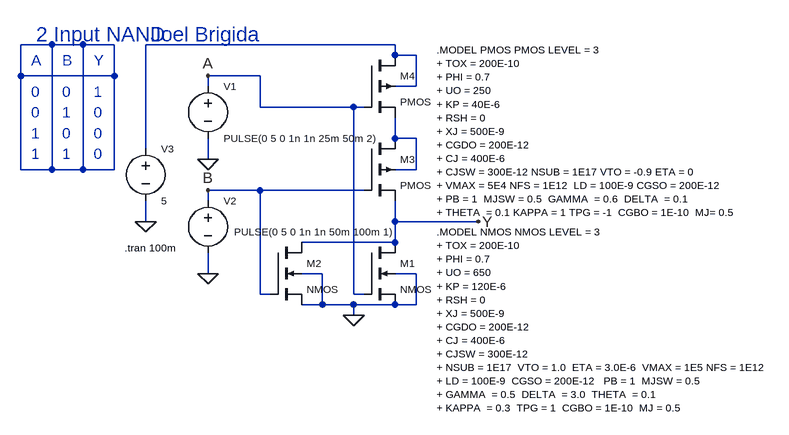
[diagram p0: schematic 2NOR.asc]
2NOR.asc, the LTspice schematic file:
Version 4
SHEET 1 880 680
WIRE -224 -128 -272 -128
WIRE -176 -128 -224 -128
WIRE -128 -128 -176 -128
WIRE 304 -128 -80 -128
WIRE 304 -112 304 -128
WIRE 336 -112 304 -112
WIRE -272 -80 -272 -128
WIRE -128 -80 -128 -128
WIRE -128 -80 -272 -80
WIRE 96 -80 16 -80
WIRE 16 -64 16 -80
WIRE 336 -64 336 -112
WIRE 336 -64 304 -64
WIRE 96 -32 96 -80
WIRE 240 -32 96 -32
WIRE 256 -32 240 -32
WIRE 304 16 304 -16
WIRE 336 16 304 16
WIRE -80 32 -80 -128
WIRE 16 48 16 16
WIRE -272 64 -272 -80
WIRE -224 64 -224 -128
WIRE -224 64 -272 64
WIRE -176 64 -176 -128
WIRE -176 64 -224 64
WIRE -128 64 -128 -80
WIRE -128 64 -176 64
WIRE 336 64 336 16
WIRE 336 64 304 64
WIRE 96 96 16 96
WIRE 256 96 96 96
WIRE 16 112 16 96
WIRE -80 144 -80 112
WIRE 304 144 304 112
WIRE 432 144 304 144
WIRE 304 176 304 144
WIRE 304 176 160 176
WIRE 16 224 16 192
WIRE 192 224 160 224
WIRE 336 224 304 224
WIRE 96 256 96 96
WIRE 112 256 96 256
WIRE 240 256 240 -32
WIRE 256 256 240 256
WIRE 192 272 192 224
WIRE 192 272 160 272
WIRE 240 272 192 272
WIRE 304 272 240 272
WIRE 336 272 336 224
WIRE 336 272 304 272
WIRE 240 288 240 272
FLAG 16 48 0
FLAG 16 224 0
FLAG -80 144 0
FLAG 240 288 0
FLAG 432 144 Y
FLAG 16 -80 A
FLAG 16 96 B
SYMBOL nmos4 256 176 R0
WINDOW 0 56 32 Left 1
WINDOW 3 56 72 Left 1
SYMATTR InstName M1
SYMBOL pmos4 256 16 R0
WINDOW 0 56 32 Left 1
WINDOW 3 56 72 Left 1
SYMATTR InstName M3
SYMBOL pmos4 256 -112 R0
WINDOW 0 56 32 Left 1
WINDOW 3 56 72 Left 1
SYMATTR InstName M4
SYMBOL voltage 16 -80 R0
WINDOW 0 24 16 Left 1
WINDOW 3 24 96 Left 1
WINDOW 123 0 0 Left 0
WINDOW 39 0 0 Left 0
SYMATTR InstName V1
SYMATTR Value PULSE(0 5 0 1n 1n 25m 50m 2)
SYMBOL voltage 16 96 R0
WINDOW 0 24 16 Left 1
WINDOW 3 40 64 Left 1
WINDOW 123 0 0 Left 0
WINDOW 39 0 0 Left 0
SYMATTR InstName V2
SYMATTR Value PULSE(0 5 0 1n 1n 50m 100m 1)
SYMBOL voltage -80 16 R0
WINDOW 0 24 16 Left 1
WINDOW 3 24 96 Left 1
WINDOW 123 0 0 Left 0
WINDOW 39 0 0 Left 0
SYMATTR InstName V3
SYMATTR Value 5
SYMBOL nmos4 112 176 R0
WINDOW 0 56 32 Left 1
WINDOW 3 56 72 Left 1
SYMATTR InstName M2
TEXT -72 -144 Left 3 ;Joel Brigida
TEXT 368 160 Left 1 !.MODEL NMOS NMOS LEVEL = 3\n+ TOX = 200E-10\n+ PHI = 0.7\n+ UO = 650\n+ KP = 120E-6\n+ RSH = 0\n+ XJ = 500E-9\n+ CGDO = 200E-12\n+ CJ = 400E-6\n+ CJSW = 300E-12\n+ NSUB = 1E17  VTO = 1.0  ETA = 3.0E-6  VMAX = 1E5 NFS = 1E12   \n+ LD = 100E-9  CGSO = 200E-12   PB = 1  MJSW = 0.5\n+ GAMMA  = 0.5  DELTA  = 3.0  THETA  = 0.1\n+ KAPPA  = 0.3  TPG = 1  CGBO = 1E-10  MJ = 0.5
TEXT 368 -120 Left 1 !.MODEL PMOS PMOS LEVEL = 3\n+ TOX = 200E-10\n+ PHI = 0.7\n+ UO = 250 \n+ KP = 40E-6\n+ RSH = 0\n+ XJ = 500E-9 \n+ CGDO = 200E-12 \n+ CJ = 400E-6\n+ CJSW = 300E-12 NSUB = 1E17 VTO = -0.9 ETA = 0\n+ VMAX = 5E4 NFS = 1E12  LD = 100E-9 CGSO = 200E-12\n+ PB = 1  MJSW = 0.5  GAMMA  = 0.6  DELTA  = 0.1\n+ THETA  = 0.1 KAPPA = 1 TPG = -1  CGBO = 1E-10  MJ= 0.5
TEXT -256 -104 Left 2 ;A
TEXT -208 -104 Left 2 ;B
TEXT -160 -104 Left 2 ;Y
TEXT -208 -24 Left 2 ;1
TEXT -208 -56 Left 2 ;0
TEXT -256 -24 Left 2 ;0
TEXT -256 -56 Left 2 ;0
TEXT -256 8 Left 2 ;1
TEXT -256 40 Left 2 ;1
TEXT -208 8 Left 2 ;0
TEXT -208 40 Left 2 ;1
TEXT -112 184 Left 1 !.tran 100m
TEXT -160 -56 Left 2 ;1
TEXT -160 8 Left 2 ;0
TEXT -160 -24 Left 2 ;0
TEXT -160 40 Left 2 ;0
TEXT -248 -144 Left 3 ;2 Input NAND

The netlist it stands for:
* 2NOR.asc
M1 Y A 0 0 NMOS
M3 N003 B Y N003 PMOS
M4 N002 A N003 N002 PMOS
V1 A 0 PULSE(0 5 0 1n 1n 25m 50m 2)
V2 B 0 PULSE(0 5 0 1n 1n 50m 100m 1)
V3 N002 0 5
M2 Y B 0 0 NMOS
.model NMOS NMOS
.model PMOS PMOS
.lib standard.mos
* Joel Brigida
.MODEL NMOS NMOS LEVEL = 3
+ TOX = 200E-10
+ PHI = 0.7
+ UO = 650
+ KP = 120E-6
+ RSH = 0
+ XJ = 500E-9
+ CGDO = 200E-12
+ CJ = 400E-6
+ CJSW = 300E-12
+ NSUB = 1E17  VTO = 1.0  ETA = 3.0E-6  VMAX = 1E5 NFS = 1E12
+ LD = 100E-9  CGSO = 200E-12   PB = 1  MJSW = 0.5
+ GAMMA  = 0.5  DELTA  = 3.0  THETA  = 0.1
+ KAPPA  = 0.3  TPG = 1  CGBO = 1E-10  MJ = 0.5
.MODEL PMOS PMOS LEVEL = 3
+ TOX = 200E-10
+ PHI = 0.7
+ UO = 250
+ KP = 40E-6
+ RSH = 0
+ XJ = 500E-9
+ CGDO = 200E-12
+ CJ = 400E-6
+ CJSW = 300E-12 NSUB = 1E17 VTO = -0.9 ETA = 0
+ VMAX = 5E4 NFS = 1E12  LD = 100E-9 CGSO = 200E-12
+ PB = 1  MJSW = 0.5  GAMMA  = 0.6  DELTA  = 0.1
+ THETA  = 0.1 KAPPA = 1 TPG = -1  CGBO = 1E-10  MJ= 0.5
* A
* B
* Y
* 1
* 0
* 0
* 0
* 1
* 1
* 0
* 1
.tran 100m
* 1
* 0
* 0
* 0
* 2 Input NAND
.backanno
.end